# EAGLE schematic PCB1 1.1 (EAGLE 6.3)
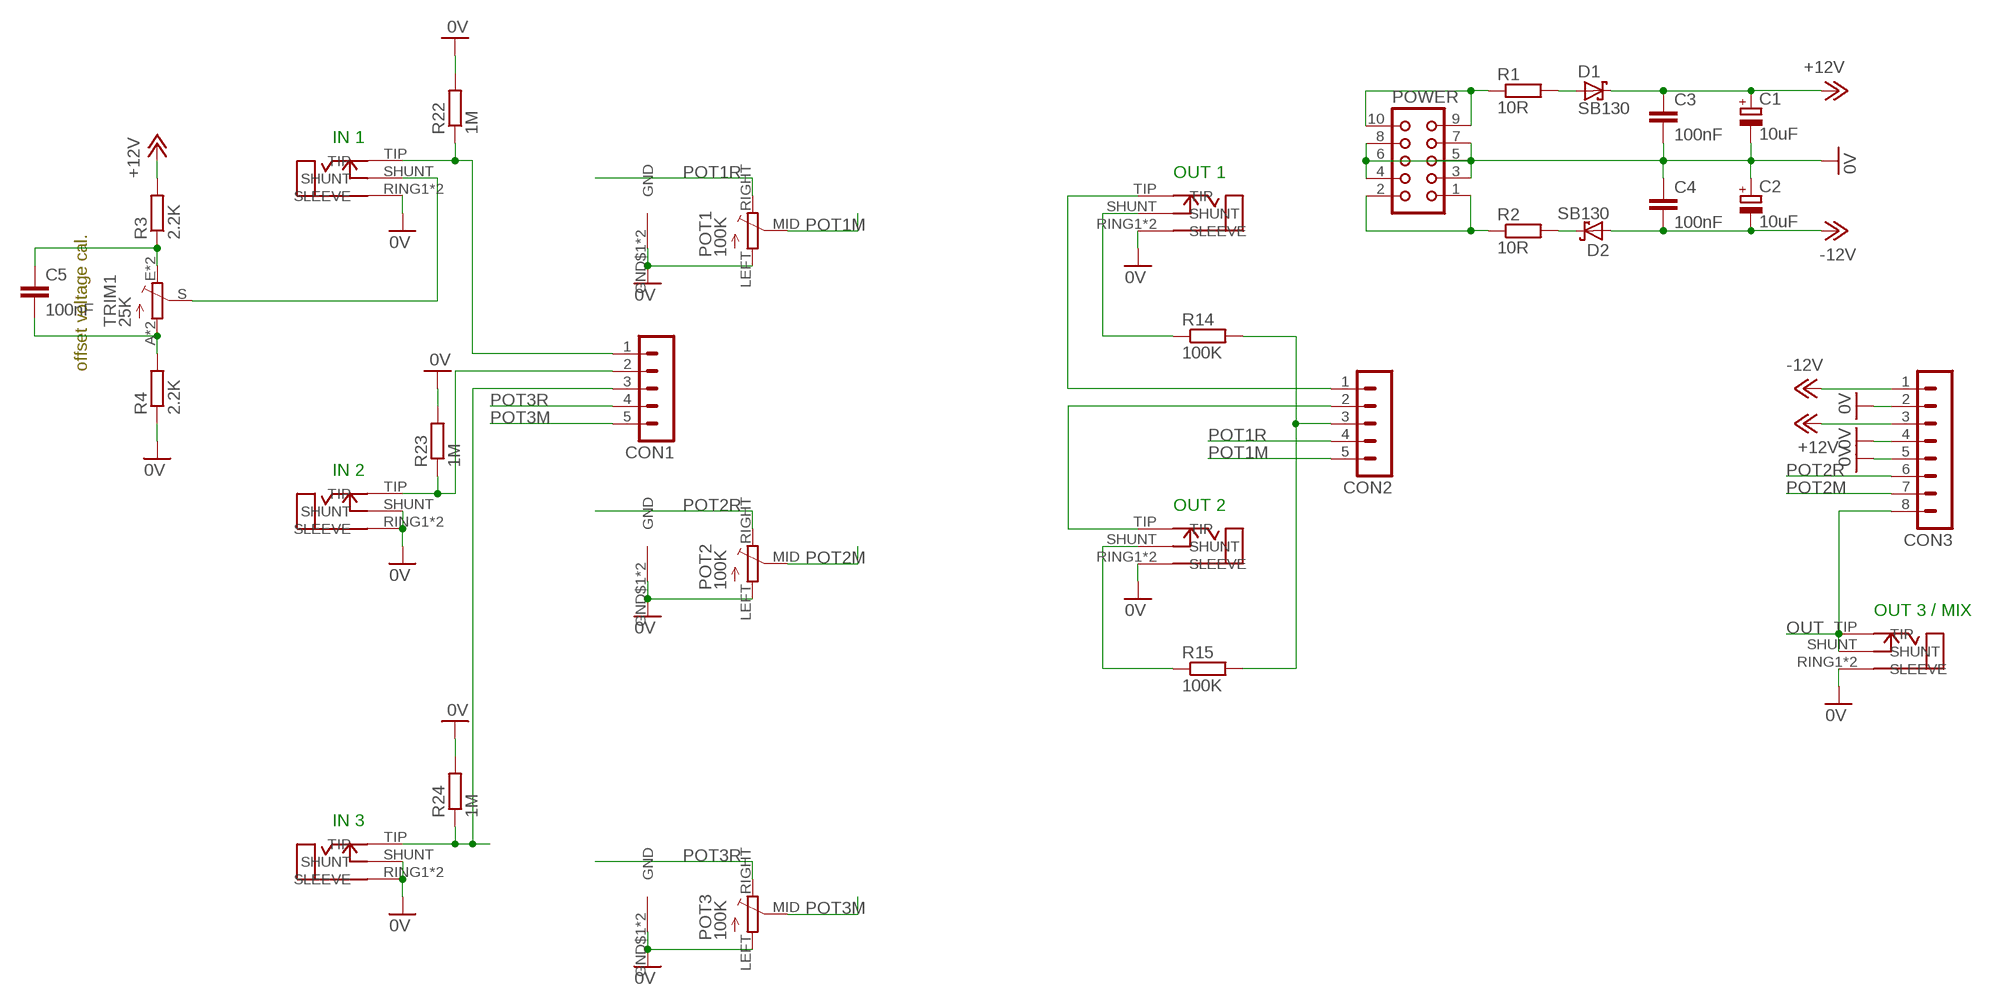
[diagram p0: schematic, sheet 1]

## Parts
C1  10uF  CPOL-EUE2-5  [E2-5]
C2  10uF  CPOL-EUE2-5  [E2-5]
C3  100nF  C-EU025-024X044  [C025-024X044]
C4  100nF  C-EU025-024X044  [C025-024X044]
C5  100nF  C-EU025-024X044  [C025-024X044]
CON1  MA05-1  [MA05-1]
CON2  MA05-1  [MA05-1]
CON3  MA08-1  [MA08-1]
D1  SB130  SB130DO-204AL  [DO41-7]
D2  SB130  SB130DO-204AL  [DO41-7]
IN1  ERTHENVAR_3.5MM_JACK  [ERTHENVAR]
IN2  ERTHENVAR_3.5MM_JACK  [ERTHENVAR]
IN3  ERTHENVAR_3.5MM_JACK  [ERTHENVAR]
OUT1  ERTHENVAR_3.5MM_JACK  [ERTHENVAR]
OUT2  ERTHENVAR_3.5MM_JACK  [ERTHENVAR]
OUT3  ERTHENVAR_3.5MM_JACK  [ERTHENVAR]
POT1  100K  POT-ALPHA9  [POT-ALPHA9]
POT2  100K  POT-ALPHA9  [POT-ALPHA9]
POT3  100K  POT-ALPHA9  [POT-ALPHA9]
POWER  CON10L  [CON10L]
R1  10R  R-EU_0207/10  [0207/9]
R2  10R  R-EU_0207/10  [0207/9]
R3  2.2K  R-EU_0207/10  [0207/9]
R4  2.2K  R-EU_0207/10  [0207/9]
R14  100K  R-EU_0207/10  [0207/9]
R15  100K  R-EU_0207/10  [0207/9]
R22  1M  R-EU_0207/10  [0207/9]
R23  1M  R-EU_0207/10  [0207/9]
R24  1M  R-EU_0207/10  [0207/9]
TRIM1  25K  TRIM_EU-B25P  [B25P]

## Nets
0V: C1.- C2.+ C3.2 C4.1 CON3.2 CON3.4 CON3.5 IN1.RING1(SLEEVE) IN1.RING2(SLEEVE) IN2.RING1(SLEEVE) IN2.RING2(SLEEVE) IN2.SHUNT IN3.RING1(SLEEVE) IN3.RING2(SLEEVE) IN3.SHUNT OUT1.RING1(SLEEVE) OUT1.RING2(SLEEVE) OUT2.RING1(SLEEVE) OUT2.RING2(SLEEVE) OUT3.RING1(SLEEVE) OUT3.RING2(SLEEVE) POT1.GND$1(GND) POT1.GND$2(GND) POT1.LEFT POT2.GND$1(GND) POT2.GND$2(GND) POT2.LEFT POT3.GND$1(GND) POT3.GND$2(GND) POT3.LEFT POWER.3 POWER.4 POWER.5 POWER.6 POWER.7 POWER.8 R4.1 R22.2 R23.2 R24.2
+12V: C1.+ C3.1 CON3.3 D1.C R3.2
-12V: C2.- C4.2 CON3.1 D2.A
N$1: POWER.9 POWER.10 R1.1
N$2: POWER.1 POWER.2 R2.1
N$4: C5.2 R4.2 TRIM1.A TRIM1.AA(A)
N$5: D1.A R1.2
N$6: D2.C R2.2
N$7: C5.1 R3.1 TRIM1.E TRIM1.EE(E)
N$8: IN1.SHUNT TRIM1.S
N$9: CON1.1 IN1.TIP R22.1
N$10: CON1.2 IN2.TIP R23.1
N$11: CON1.3 IN3.TIP R24.1
N$19: CON2.1 OUT1.TIP
N$20: CON2.2 OUT2.TIP
N$26: OUT1.SHUNT R14.1
N$27: OUT2.SHUNT R15.1
N$33: CON2.3 R14.2 R15.2
OUT: CON3.8 OUT3.SHUNT OUT3.TIP
POT1M: CON2.5 POT1.MID
POT1R: CON2.4 POT1.RIGHT
POT2M: CON3.7 POT2.MID
POT2R: CON3.6 POT2.RIGHT
POT3M: CON1.5 POT3.MID
POT3R: CON1.4 POT3.RIGHT

## Notes on the sheet
- IN 1
- OUT 1
- offset voltage cal.
- IN 2
- OUT 2
- OUT 3 / MIX
- IN 3

## Library data of the parts
C1 C2 = Roll Your Own:CPOL-EU: POLARIZED CAPACITOR, European symbol
C3-C5 = Roll Your Own:C-EU: CAPACITOR, European symbol
CON1 CON2 = Roll Your Own:MA05-1: PIN HEADER; OC_FARNELL: unknown; OC_NEWARK: unknown
CON3 = Roll Your Own:MA08-1: PIN HEADER; OC_FARNELL: unknown; OC_NEWARK: unknown
D1 D2 = Roll Your Own:SB130
IN1-IN3 OUT1-OUT3 = Roll Your Own:ERTHENVAR_3.5MM_JACK
POT1-POT3 = Roll Your Own:POT-ALPHA9
POWER = Roll Your Own:CON10L: CONNECTOR; OC_FARNELL: unknown; OC_NEWARK: unknown
R1-R4 R14 R15 R22-R24 = Roll Your Own:R-EU_: RESISTOR, European symbol
TRIM1 = Roll Your Own:TRIM_EU-: POTENTIOMETER